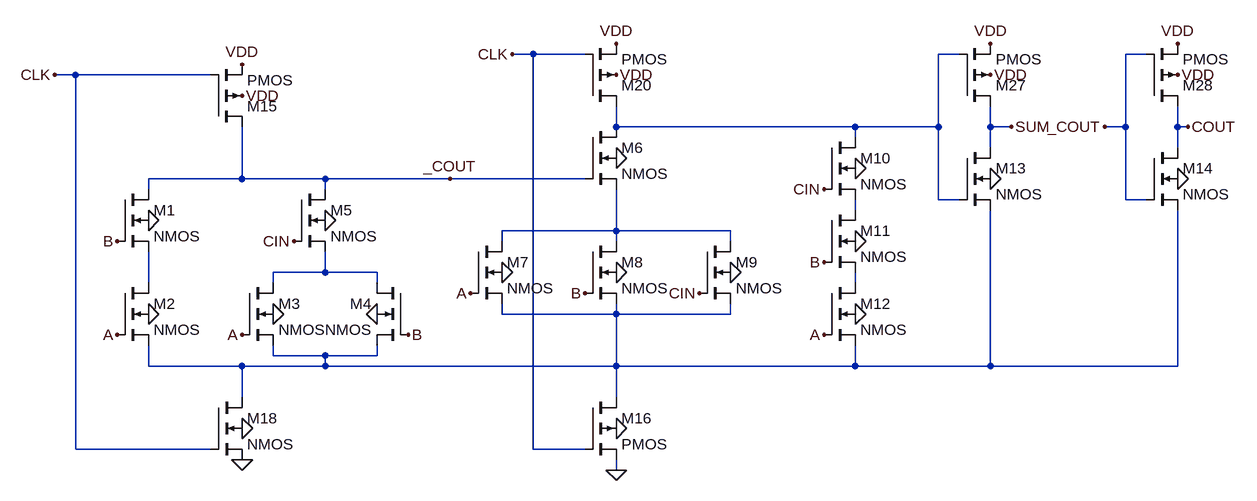
[diagram p0: schematic FA_domino.asc]
FA_domino.asc, the LTspice schematic file:
Version 4
SHEET 1 1280 692
WIRE 192 32 160 32
WIRE 272 32 192 32
WIRE 848 32 816 32
WIRE 1136 32 1104 32
WIRE -512 64 -544 64
WIRE -304 64 -512 64
WIRE 320 144 320 112
WIRE 688 144 320 144
WIRE 816 144 816 32
WIRE 816 144 688 144
WIRE 896 144 896 112
WIRE 928 144 896 144
WIRE 1104 144 1104 32
WIRE 1104 144 1072 144
WIRE 1184 144 1184 112
WIRE 1200 144 1184 144
WIRE 688 160 688 144
WIRE 896 176 896 144
WIRE 1184 176 1184 144
WIRE -256 224 -256 144
WIRE -256 224 -400 224
WIRE -128 224 -256 224
WIRE 64 224 -128 224
WIRE 272 224 64 224
WIRE -400 240 -400 224
WIRE -128 240 -128 224
WIRE 816 256 816 144
WIRE 848 256 816 256
WIRE 1104 256 1104 144
WIRE 1136 256 1104 256
WIRE 688 272 688 256
WIRE 320 304 320 240
WIRE 320 304 144 304
WIRE 496 304 320 304
WIRE 144 320 144 304
WIRE 320 320 320 304
WIRE 496 320 496 304
WIRE -128 368 -128 336
WIRE -128 368 -208 368
WIRE -48 368 -128 368
WIRE -400 384 -400 336
WIRE -208 384 -208 368
WIRE -48 384 -48 368
WIRE 688 384 688 368
WIRE 144 432 144 416
WIRE 320 432 320 416
WIRE 320 432 144 432
WIRE 496 432 496 416
WIRE 496 432 320 432
WIRE -208 496 -208 480
WIRE -128 496 -208 496
WIRE -48 496 -48 480
WIRE -48 496 -128 496
WIRE -400 512 -400 480
WIRE -256 512 -400 512
WIRE -128 512 -128 496
WIRE -128 512 -256 512
WIRE 320 512 320 432
WIRE 320 512 -128 512
WIRE 688 512 688 480
WIRE 688 512 320 512
WIRE 896 512 896 272
WIRE 896 512 688 512
WIRE 1184 512 1184 272
WIRE 1184 512 896 512
WIRE -256 560 -256 512
WIRE 320 560 320 512
WIRE -512 640 -512 64
WIRE -304 640 -512 640
WIRE 192 640 192 32
WIRE 272 640 192 640
WIRE 320 672 320 656
FLAG -448 464 A
FLAG -256 464 A
FLAG 96 400 A
FLAG 640 464 A
FLAG -448 320 B
FLAG 0 464 B
FLAG 272 400 B
FLAG 640 352 B
FLAG -176 320 CIN
FLAG 448 400 CIN
FLAG 640 240 CIN
FLAG -400 432 0
FLAG -400 288 0
FLAG -128 288 0
FLAG -208 432 0
FLAG -48 432 0
FLAG 144 368 0
FLAG 320 192 0
FLAG 496 368 0
FLAG 320 368 0
FLAG 688 432 0
FLAG 688 320 0
FLAG 688 208 0
FLAG 896 224 0
FLAG 1184 224 0
FLAG 320 64 VDD
FLAG 896 64 VDD
FLAG 1184 64 VDD
FLAG 928 144 SUM
FLAG 1072 144 _COUT
FLAG 1200 144 COUT
FLAG 64 224 _COUT
FLAG -256 48 VDD
FLAG -544 64 CLK
FLAG -256 656 0
FLAG -256 96 VDD
FLAG 320 16 VDD
FLAG 160 32 CLK
FLAG 320 672 0
FLAG 320 608 0
FLAG 896 16 VDD
FLAG 1184 16 VDD
FLAG -256 608 0
SYMBOL nmos4 -448 240 R0
SYMATTR InstName M1
SYMBOL nmos4 -448 384 R0
SYMATTR InstName M2
SYMBOL nmos4 -256 384 R0
SYMATTR InstName M3
SYMBOL nmos4 0 384 M0
SYMATTR InstName M4
SYMBOL nmos4 -176 240 R0
SYMATTR InstName M5
SYMBOL nmos4 272 144 R0
SYMATTR InstName M6
SYMBOL nmos4 96 320 R0
SYMATTR InstName M7
SYMBOL nmos4 272 320 R0
SYMATTR InstName M8
SYMBOL nmos4 448 320 R0
SYMATTR InstName M9
SYMBOL nmos4 640 160 R0
SYMATTR InstName M10
SYMBOL nmos4 640 272 R0
SYMATTR InstName M11
SYMBOL nmos4 640 384 R0
SYMATTR InstName M12
SYMBOL nmos4 848 176 R0
SYMATTR InstName M13
SYMBOL nmos4 1136 176 R0
SYMATTR InstName M14
SYMBOL pmos4 272 112 M180
SYMATTR InstName M20
SYMBOL pmos4 848 112 M180
SYMATTR InstName M27
SYMBOL pmos4 1136 112 M180
SYMATTR InstName M28
SYMBOL pmos4 -304 144 M180
SYMATTR InstName M15
SYMBOL nmos4 -304 560 R0
SYMATTR InstName M18
SYMBOL pmos4 272 560 R0
SYMATTR InstName M16

The netlist it stands for:
* FA_domino.asc
M1 _COUT B N005 0 NMOS
M2 N005 A N007 0 NMOS
M3 N004 A N007 0 NMOS
M4 N004 B N007 0 NMOS
M5 _COUT CIN N004 0 NMOS
M6 N001 _COUT N003 0 NMOS
M7 N003 A N007 0 NMOS
M8 N003 B N007 0 NMOS
M9 N003 CIN N007 0 NMOS
M10 N001 CIN N002 0 NMOS
M11 N002 B N006 0 NMOS
M12 N006 A N007 0 NMOS
M13 SUM N001 N007 0 NMOS
M14 COUT _COUT N007 0 NMOS
M20 N001 CLK VDD VDD PMOS
M27 SUM N001 VDD VDD PMOS
M28 COUT _COUT VDD VDD PMOS
M15 _COUT CLK VDD VDD PMOS
M18 N007 CLK 0 0 NMOS
M16 N007 CLK 0 0 PMOS
.model NMOS NMOS
.model PMOS PMOS
.lib standard.mos
.backanno
.end